# EAGLE design power_strip_monitor_reduced (EAGLE 6.1)
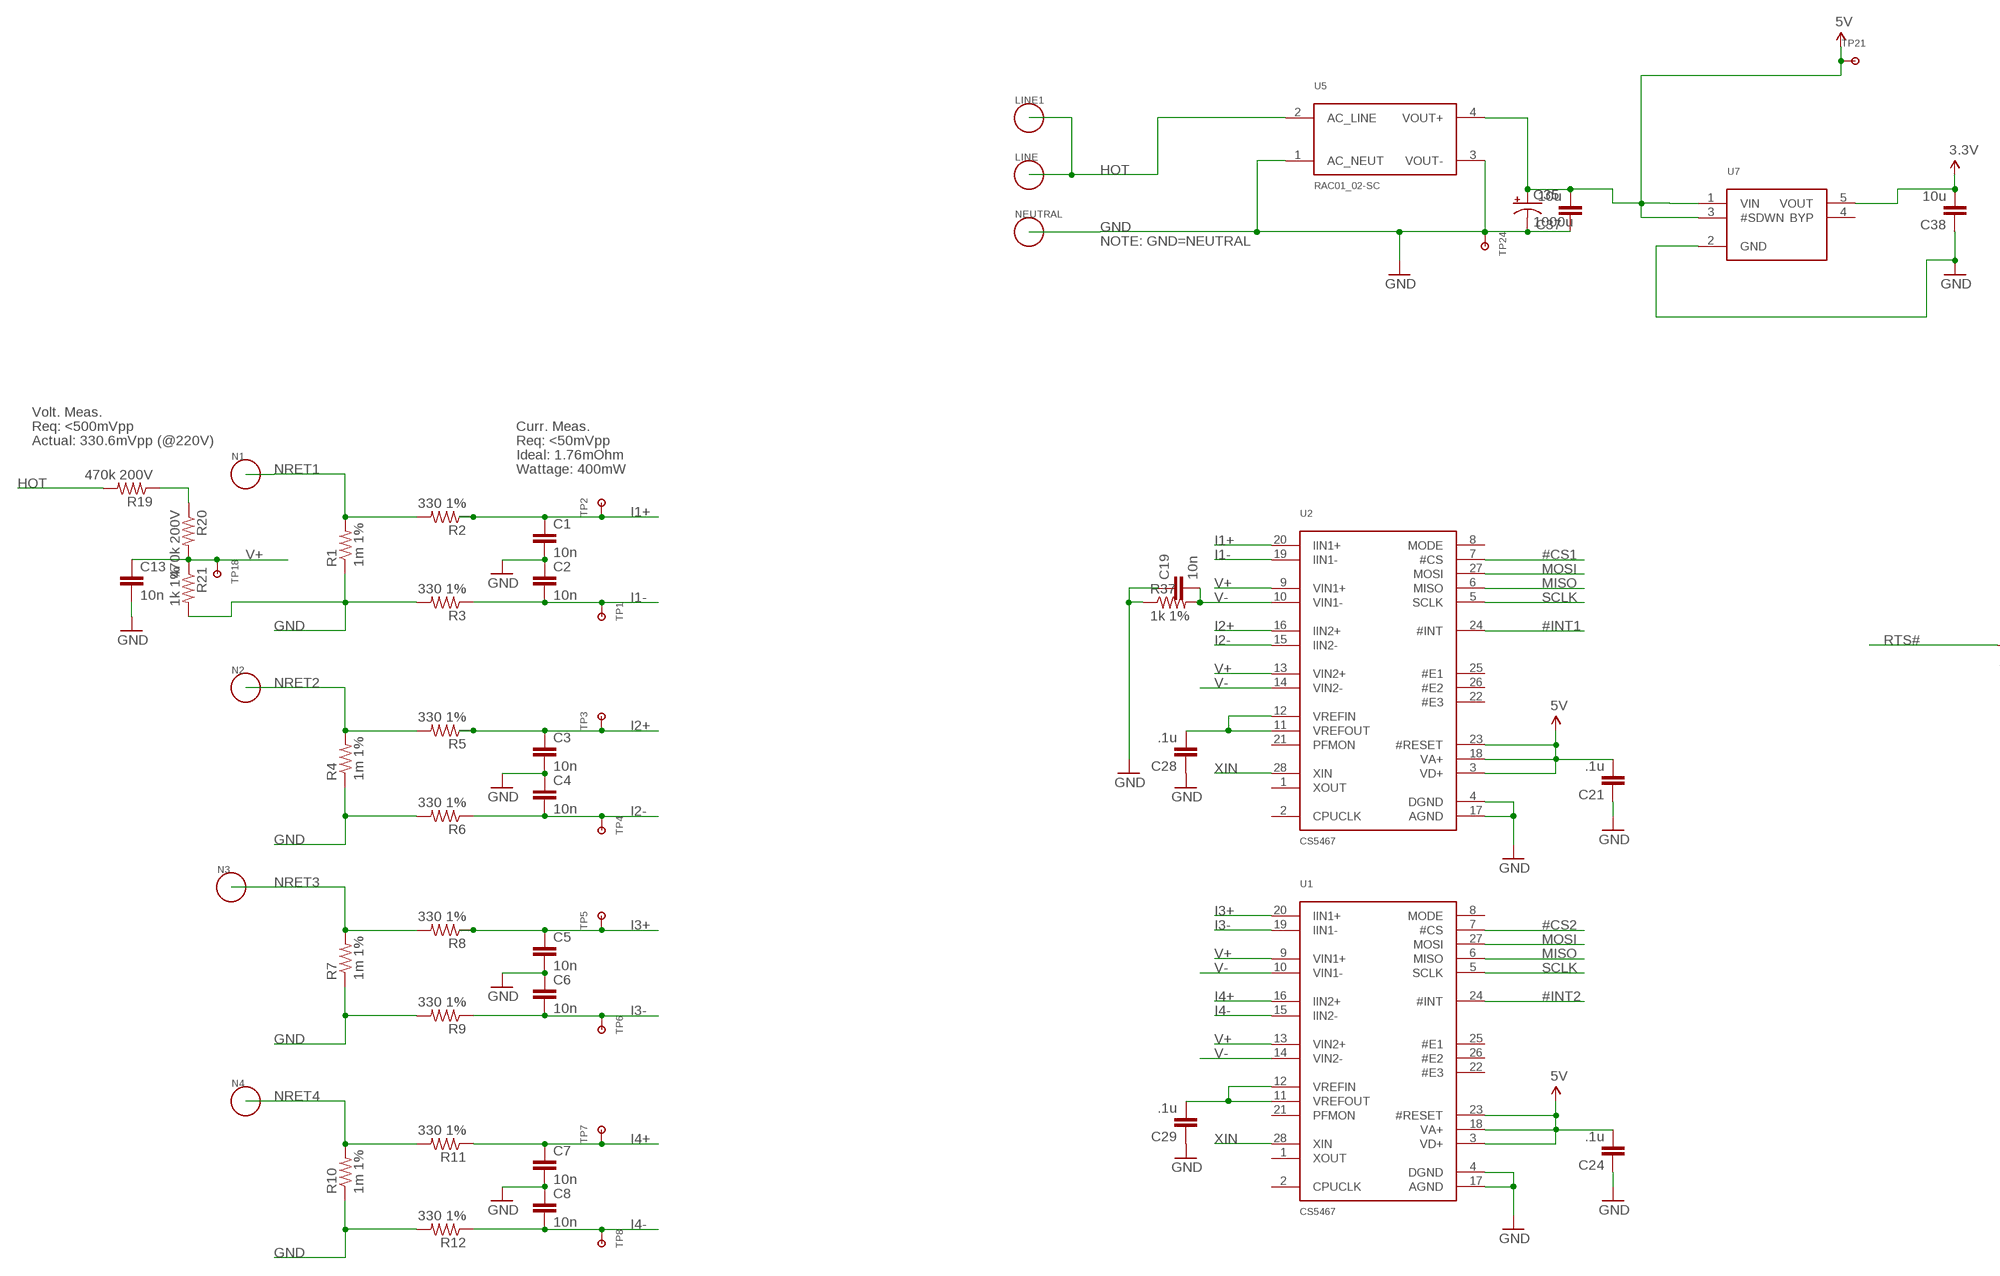
[diagram p0: schematic, sheet 1, part 1 of 2]
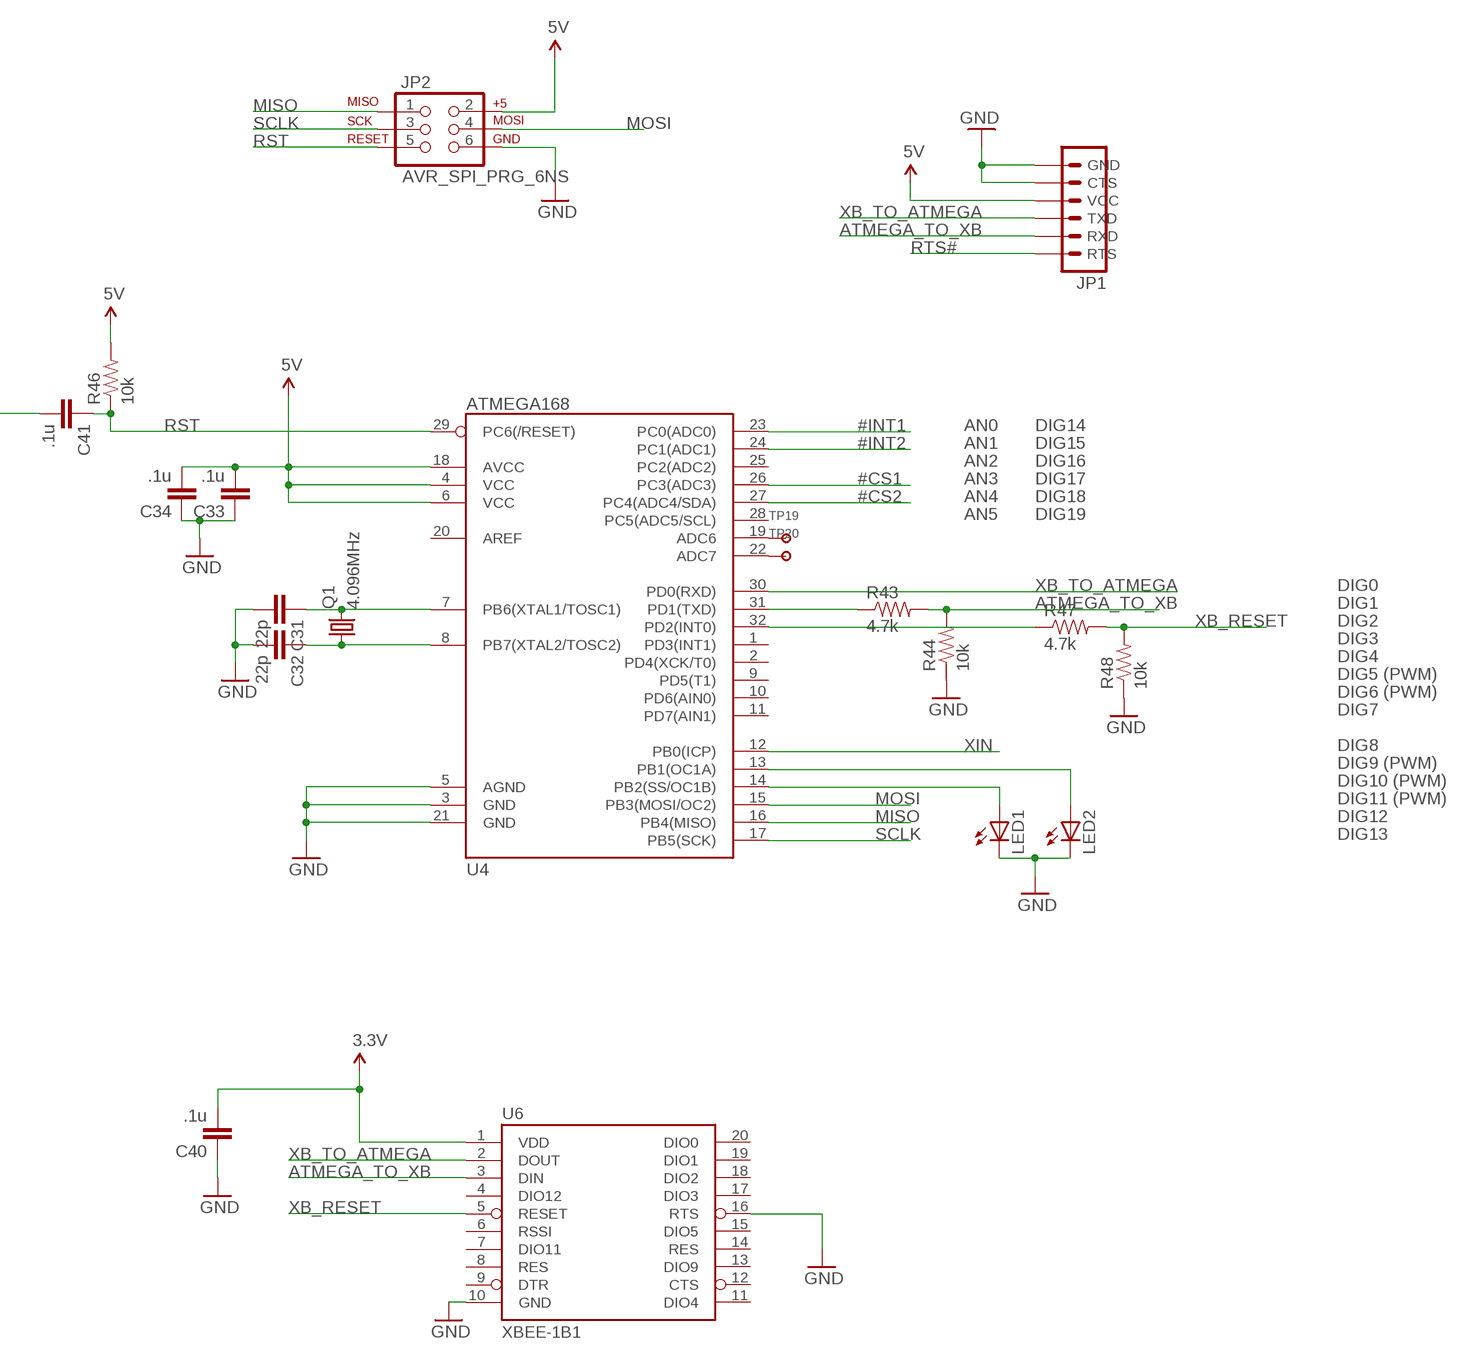
[diagram p1: schematic, sheet 1, part 2 of 2]

## Parts
C1  10n  CAP0603  [0603]
C2  10n  CAP0603  [0603]
C3  10n  CAP0603  [0603]
C4  10n  CAP0603  [0603]
C5  10n  CAP0603  [0603]
C6  10n  CAP0603  [0603]
C7  10n  CAP0603  [0603]
C8  10n  CAP0603  [0603]
C13  10n  CAP0603  [0603]
C19  10n  CAP0603  [0603]
C21  .1u  CAP0603  [0603]
C24  .1u  CAP0603  [0603]
C28  .1u  CAP0603  [0603]
C29  .1u  CAP0603  [0603]
C31  22p  CAP0603  [0603]
C32  22p  CAP0603  [0603]
C33  .1u  CAP0603  [0603]
C34  .1u  CAP0603  [0603]
C35  1000u  CPOL-USG  [PANASONIC_G]
C37  10u  CAP0603  [0603]
C38  10u  CAP0603  [0603]
C40  .1u  CAP0603  [0603]
C41  .1u  CAP0603  [0603]
JP1  FTDI_CABLESIP  [1X06]
JP2  AVR_SPI_PRG_6NS  [2X3-NS]
LED1  LEDCHIPLED_0805  [CHIPLED_0805]
LED2  LEDCHIPLED_0805  [CHIPLED_0805]
LINE  1P_HOLE  [14GAUGE_HOLE]
LINE1  1P_HOLE  [14GAUGE_HOLE]
N1  1P_HOLE  [14GAUGE_HOLE]
N2  1P_HOLE  [14GAUGE_HOLE]
N3  1P_HOLE  [14GAUGE_HOLE]
N4  1P_HOLE  [14GAUGE_HOLE]
NEUTRAL  1P_HOLE  [14GAUGE_HOLE]
Q1  4.096MHz  CRYSTALSMD  [HC49UP]
R1  1m 1%  R-US_R2512  [R2512]
R2  330 1%  RESISTOR0603  [0603]
R3  330 1%  RESISTOR0603  [0603]
R4  1m 1%  R-US_R2512  [R2512]
R5  330 1%  RESISTOR0603  [0603]
R6  330 1%  RESISTOR0603  [0603]
R7  1m 1%  R-US_R2512  [R2512]
R8  330 1%  RESISTOR0603  [0603]
R9  330 1%  RESISTOR0603  [0603]
R10  1m 1%  R-US_R2512  [R2512]
R11  330 1%  RESISTOR0603  [0603]
R12  330 1%  RESISTOR0603  [0603]
R19  470k 200V  RESISTOR1206  [1206]
R20  470k 200V  RESISTOR1206  [1206]
R21  1k 1%  RESISTOR0603  [0603]
R37  1k 1%  RESISTOR0603  [0603]
R43  4.7k  RESISTOR0603  [0603]
R44  10k  RESISTOR0603  [0603]
R46  10k  RESISTOR0603  [0603]
R47  4.7k  RESISTOR0603  [0603]
R48  10k  RESISTOR0603  [0603]
TP1  TESTPOINTSMALLEST  [TESTPOINT]
TP2  TESTPOINTSMALLEST  [TESTPOINT]
TP3  TESTPOINTSMALLEST  [TESTPOINT]
TP4  TESTPOINTSMALLEST  [TESTPOINT]
TP5  TESTPOINTSMALLEST  [TESTPOINT]
TP6  TESTPOINTSMALLEST  [TESTPOINT]
TP7  TESTPOINTSMALLEST  [TESTPOINT]
TP8  TESTPOINTSMALLEST  [TESTPOINT]
TP18  TESTPOINTSMALLEST  [TESTPOINT]
TP19  TESTPOINTSMALLEST  [TESTPOINT]
TP20  TESTPOINTSMALLEST  [TESTPOINT]
TP21  TESTPOINT100MIL  [TESTPOINT-100MIL]
TP24  TESTPOINT100MIL  [TESTPOINT-100MIL]
U1  CS5467  [SSOP28L_CIRRUS]
U2  CS5467  [SSOP28L_CIRRUS]
U4  ATMEGA168  [TQFP32-08]
U5  RAC01_02-SC  [RAC01_02-SC]
U6  XBEE-1B1  [XBEE-1]
U7  LT1761-X  [TSOT23-5_LINEAR]

## Nets
3.3V [power]: C38.2 C40.2 U6.1(VDD) U7.5(VOUT)
5V [power]: C21.2 C24.2 C33.2 C34.2 C35.+ C37.2 JP1.3(VCC) JP2.2 R46.2 TP21.2 U1.3(VD+) U1.18(VA+) U1.23(#RESET) U2.3(VD+) U2.18(VA+) U2.23(#RESET) U4.4(VCC) U4.6(VCC) U4.18(AVCC) U5.4(VOUT+) U7.1(VIN) U7.3(#SDWN)
#CS1: U2.7(#CS) U4.26(PC3(ADC3))
#CS2: U1.7(#CS) U4.27(PC4(ADC4/SDA))
#INT1: U2.24(#INT) U4.23(PC0(ADC0))
#INT2: U1.24(#INT) U4.24(PC1(ADC1))
ATMEGA_TO_XB: JP1.5(RXD) R43.2 R44.2 U6.3(DIN)
GND [power]: C1.2 C2.1 C3.2 C4.1 C5.2 C6.1 C7.2 C8.1 C13.2 C19.1 C21.1 C24.1 C28.1 C29.1 C31.2 C32.2 C33.1 C34.1 C35.- C37.1 C38.1 C40.1 JP1.1(GND) JP1.2(CTS) JP2.6 LED1.C LED2.C NEUTRAL.P$1 R1.1 R3.2 R4.1 R6.2 R7.1 R9.2 R10.1 R12.2 R21.2 R37.1 R44.1 R48.1 TP24.2 U1.4(DGND) U1.17(AGND) U2.4(DGND) U2.17(AGND) U4.3(GND) U4.5(AGND) U4.21(GND) U5.1(AC_NEUT) U5.3(VOUT-) U6.10(GND) U6.16(RTS) U7.2(GND)
HOT: LINE1.P$1 LINE.P$1 R19.2 U5.2(AC_LINE)
I1+: C1.1 R2.1 TP2.P$1 U2.20(IIN1+)
I1-: C2.2 R3.1 TP1.P$1 U2.19(IIN1-)
I2+: C3.1 R5.1 TP3.P$1 U2.16(IIN2+)
I2-: C4.2 R6.1 TP4.P$1 U2.15(IIN2-)
I3+: C5.1 R8.1 TP5.P$1 U1.20(IIN1+)
I3-: C6.2 R9.1 TP6.P$1 U1.19(IIN1-)
I4+: C7.1 R11.1 TP7.P$1 U1.16(IIN2+)
I4-: C8.2 R12.1 TP8.P$1 U1.15(IIN2-)
MISO: JP2.1 U1.6(MISO) U2.6(MISO) U4.16(PB4(MISO))
MOSI: JP2.4 U1.27(MOSI) U2.27(MOSI) U4.15(PB3(MOSI/OC2))
N$1: LED2.A U4.13(PB1(OC1A))
N$2: R19.1 R20.1
N$3: LED1.A U4.14(PB2(SS/OC1B))
N$11: C29.2 U1.11(VREFOUT) U1.12(VREFIN)
N$15: C28.2 U2.11(VREFOUT) U2.12(VREFIN)
N$16: C31.1 Q1.2 U4.7(PB6(XTAL1/TOSC1))
N$17: C32.1 Q1.1 U4.8(PB7(XTAL2/TOSC2))
N$18: TP19.P$1 U4.19(ADC6)
N$19: TP20.P$1 U4.22(ADC7)
N$20: R43.1 U4.31(PD1(TXD))
N$22: R47.1 U4.32(PD2(INT0))
NRET1: N1.P$1 R1.2 R2.2
NRET2: N2.P$1 R4.2 R5.2
NRET3: N3.P$1 R7.2 R8.2
NRET4: N4.P$1 R10.2 R11.2
RST: C41.1 JP2.5 R46.1 U4.29(PC6(/RESET))
RTS#: C41.2 JP1.6(RTS)
SCLK: JP2.3 U1.5(SCLK) U2.5(SCLK) U4.17(PB5(SCK))
V+: C13.1 R20.2 R21.1 TP18.P$1 U1.9(VIN1+) U1.13(VIN2+) U2.9(VIN1+) U2.13(VIN2+)
V-: C19.2 R37.2 U1.10(VIN1-) U1.14(VIN2-) U2.10(VIN1-) U2.14(VIN2-)
XB_RESET: R47.2 R48.2 U6.5(RESET)
XB_TO_ATMEGA: JP1.4(TXD) U4.30(PD0(RXD)) U6.2(DOUT)
XIN: U1.28(XIN) U2.28(XIN) U4.12(PB0(ICP))
Unconnected: U1.1(XOUT) U1.2(CPUCLK) U1.8(MODE) U1.21(PFMON) U1.22(#E3) U1.25(#E1) U1.26(#E2) U2.1(XOUT) U2.2(CPUCLK) U2.8(MODE) U2.21(PFMON) U2.22(#E3) U2.25(#E1) U2.26(#E2) U4.1(PD3(INT1)) U4.2(PD4(XCK/T0)) U4.9(PD5(T1)) U4.10(PD6(AIN0)) U4.11(PD7(AIN1)) U4.20(AREF) U4.25(PC2(ADC2)) U4.28(PC5(ADC5/SCL)) U6.4(DIO12) U6.6(RSSI) U6.7(DIO11) U6.8(RES) U6.9(DTR) U6.11(DIO4) U6.12(CTS) U6.13(DIO9) U6.14(RES) U6.15(DIO5) U6.17(DIO3) U6.18(DIO2) U6.19(DIO1) U6.20(DIO0) U7.4(BYP)

## Notes on the sheet
- NOTE: GND=NEUTRAL
- Volt. Meas.
- Req: <500mVpp | Curr. Meas.
- Actual: 330.6mVpp (@220V) | Req: <50mVpp
- Ideal: 1.76mOhm
- Wattage: 400mW
- AN0 | DIG14
- AN1 | DIG15
- AN2 | DIG16
- AN3 | DIG17
- AN4 | DIG18
- AN5 | DIG19
- DIG0
- DIG1
- DIG2
- DIG3
- DIG4
- DIG5 (PWM)
- DIG6 (PWM)
- DIG7
- DIG8
- DIG9 (PWM)
- DIG10 (PWM)
- DIG11 (PWM)
- DIG12
- DIG13

## Library data of the parts
C1-C8 C13 C19 C21 C24 C28 C29 C31-C34 C37 C38 C40 C41 = SparkFun:CAP: Capacitor Standard 0603 ceramic capacitor, and 0.1" leaded capacitor.
C35 = rcl_new:CPOL-US: POLARIZED CAPACITOR, American symbol
JP1 = custom:FTDI_CABLE: Header 6 Standard 6-pin 0.1" header. Use with straight break away headers (SKU : PRT-00116), right angle break away headers (PRT-00553), swiss pins (PRT-00743), machine pins (PRT-00117), and female headers (PRT-00115). Molex polarized connector foot print use with SKU : PRT-08094 with associated crimp pins and housings. NOTES ON THE VARIANTS LOCK and LOCK_LONGPADS... This footprint was designed to help hold the alignment of a through-hole component (i.e. 6-pin header) while soldering it into place. You may notice that each hole has been shifted either up or down by 0.005 of an inch from it's more standard position (which is a perfectly straight line). This slight alteration caused the pins (the squares in the middle) to touch the edges of the holes. Because they are alternating, it causes a "brace" to hold the component in place. 0.005 has proven to be the perfect amount of "off-center" position when using our standard breakaway headers. Although looks a little odd when you look at the bare footprint, once you have a header in there, the alteration is very hard to notice. Also, if you push a header all the way into place, it is covered up entirely on the bottom side. This idea of altering the position of holes to aid alignment will be further integrated into the Sparkfun Library for other footprints. It can help hold any component with 3 or more connection pins.
JP2 = SparkFun:AVR_SPI_PRG_6: AVR ISP 6 Pin This is the reduced ISP connector for AVR programming. Common on Arduino. This footprint will take up less PCB space and can be used with a 10-pin to 6-pin adapter such as SKU: BOB-08508
LED1 LED2 = led:LED: LED OSRAM: - CHIPLED LG R971, LG N971, LY N971, LG Q971, LY Q971, LO R971, LY R971 LH N974, LH R974 LS Q976, LO Q976, LY Q976 LO Q996 - Hyper CHIPLED LW Q18S LB Q993, LB Q99A, LB R99A - SideLED LS A670, LO A670, LY A670, LG A670, LP A670 LB A673, LV A673, LT A673, LW A673 LH A674 LY A675 LS A676, LA A676, LO A676, LY A676, LW A676 LS A679, LY A679, LG A679 - Hyper Micro SIDELED® LS Y876, LA Y876, LO Y876, LY Y876 LT Y87S - SmartLED LW L88C, LW L88S LB L89C, LB L89S, LG L890 LS L89K, LO L89K, LY L89K LS L896, LA L896, LO L896, LY L896 - TOPLED LS T670, LO T670, LY T670, LG T670, LP T670 LSG T670, LSP T670, LSY T670, LOP T670, LYG T670 LG T671, LOG T671, LSG T671 LB T673, LV T673, LT T673, LW T673 LH T674 LS T676, LA T676, LO T676, LY T676, LB T676, LH T676, LSB T676, LW T676 LB T67C, LV T67C, LT T67C, LS T67K, LO T67K, LY T67K, LW E67C LS E67B, LA E67B, LO E67B, LY E67B, LB E67C, LV E67C, LT E67C LW T67C LS T679, LY T679, LG T679 LS T770, LO T770, LY T770, LG T770, LP T770 LB T773, LV T773, LT T773, LW T773 LH T774 LS E675, LA E675, LY E675, LS T675 LS T776, LA T776, LO T776, LY T776, LB T776 LHGB T686 LT T68C, LB T68C - Hyper Mini TOPLED® LB M676 - Mini TOPLED Santana® LG M470 LS M47K, LO M47K, LY M47K Source: http://www.osram.convergy.de LUXEON: - LUMILED® LXK2-PW12-R00, LXK2-PW12-S00, LXK2-PW14-U00, LXK2-PW14-V00 LXK2-PM12-R00, LXK2-PM12-S00, LXK2-PM14-U00 LXK2-PE12-Q00, LXK2-PE12-R00, LXK2-PE12-S00, LXK2-PE14-T00, LXK2-PE14-U00 LXK2-PB12-K00, LXK2-PB12-L00, LXK2-PB12-M00, LXK2-PB14-N00, LXK2-PB14-P00, LXK2-PB14-Q00 LXK2-PR12-L00, LXK2-PR12-M00, LXK2-PR14-Q00, LXK2-PR14-R00 LXK2-PD12-Q00, LXK2-PD12-R00, LXK2-PD12-S00 LXK2-PH12-R00, LXK2-PH12-S00 LXK2-PL12-P00, LXK2-PL12-Q00, LXK2-PL12-R00 Source: www.luxeon.com KINGBRIGHT: KA-3528ASYC Source: www.kingbright.com
LINE LINE1 N1-N4 NEUTRAL = Cool_Electricity:1P_HOLE
Q1 = SparkFun:CRYSTAL: Crystals Various standard crystals. Proven footprints. Spark Fun Electronics SKU : COM-00534
R1 R4 R7 R10 = rcl:R-US_: RESISTOR, American symbol
R2 R3 R5 R6 R8 R9 R11 R12 R19-R21 R37 R43 R44 R46-R48 = SparkFun:RESISTOR: Resistor Basic schematic elements and footprints for 0603, 1206, and PTH 1/10th watt (small) resistors.
TP1-TP8 TP18-TP21 TP24 = WSNlib:TESTPOINT: Generic Testpoint
U1 U2 = Cool_Electricity:CS5467: CS5467 Power monitoring chip
U4 = SparkFun:ATMEGA168
U5 = Cool_Electricity:RAC01_02-SC: RAC_01_02-SC AC/DC converter 1W 5V out
U6 = SparkFun:XBEE-1
U7 = Cool_Electricity:LT1761-X: LT1761-X LDO Voltage Regulator

## Net classes
0 default: width 0.254 mm, drill 0.33 mm, clearance 0.254 mm
1 power: width 0.254 mm, drill 0.33 mm, clearance 0.254 mm

## Board
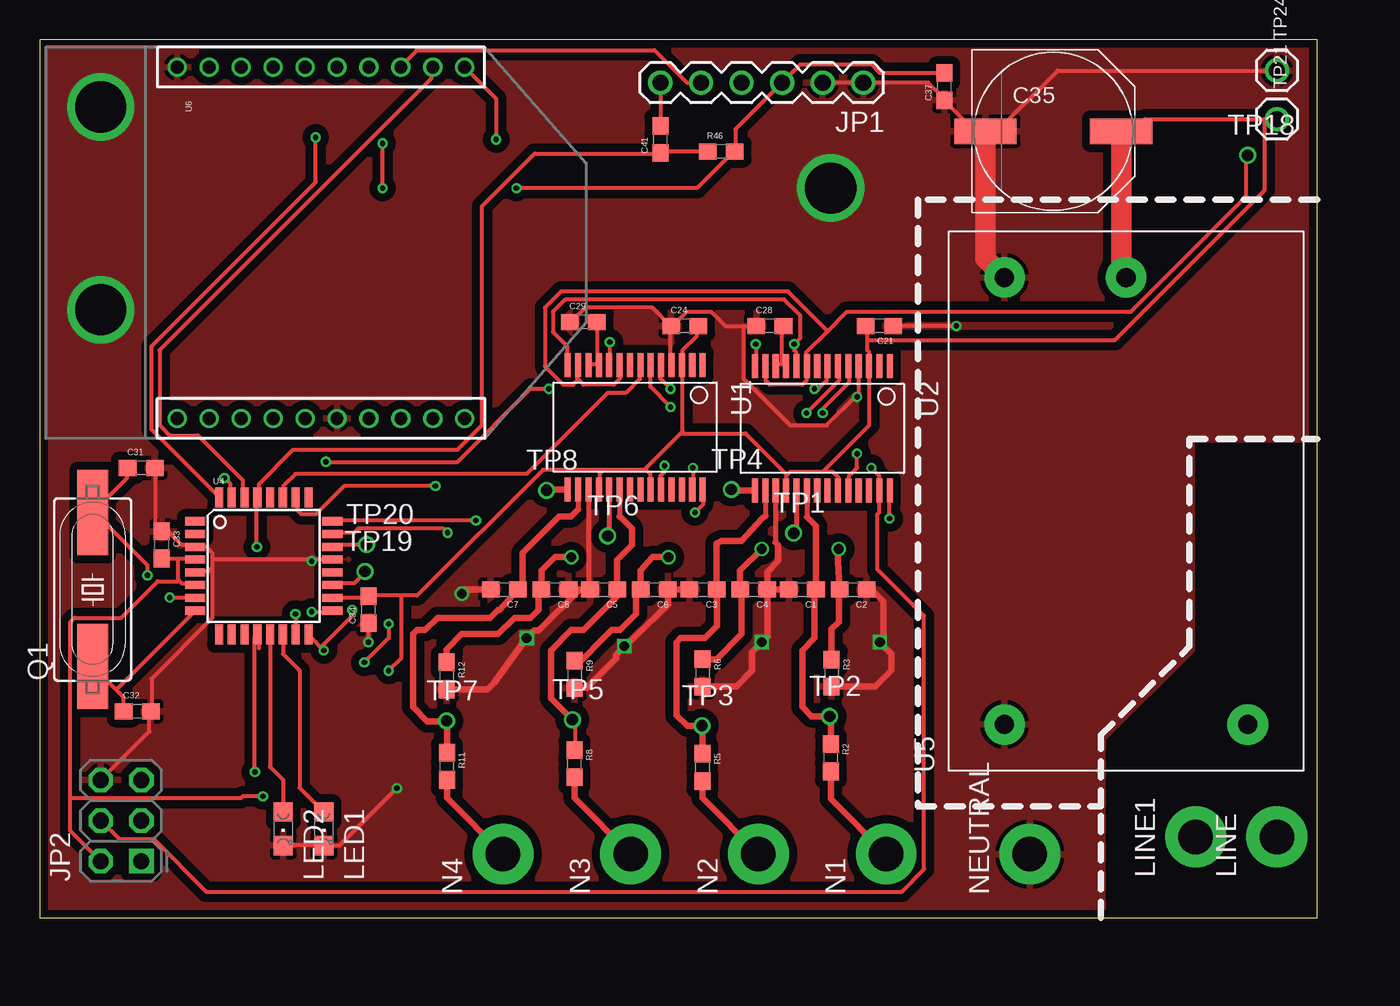
[diagram p2: board, top side]
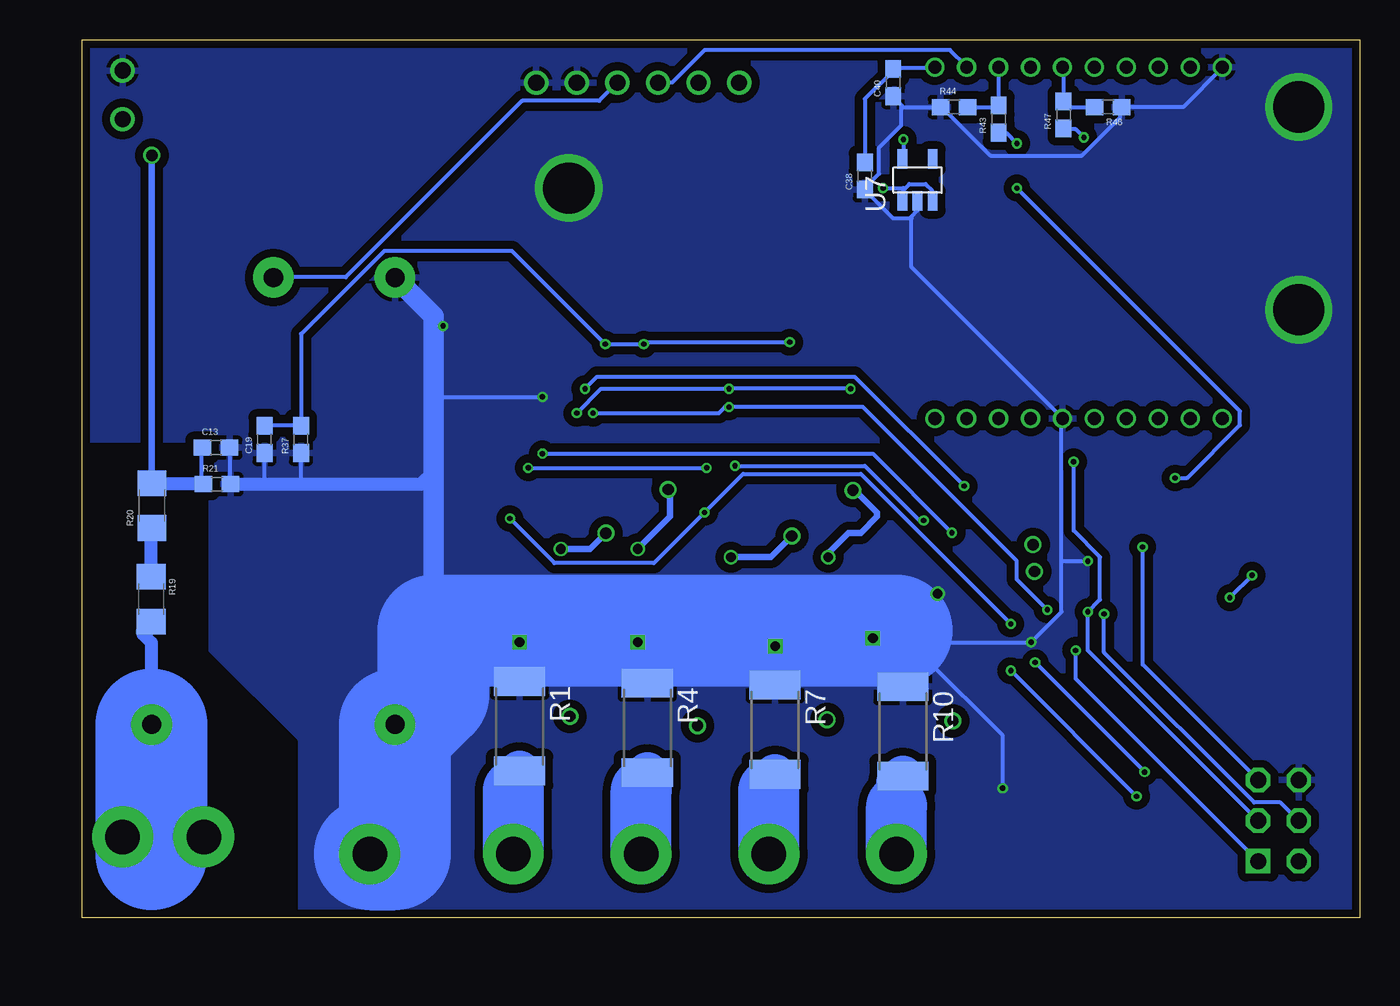
[diagram p3: board, bottom side, seen from below]

Size 80 x 55 mm. Coordinates in mm from the lower left corner, seen from the top.
Outline: 0,0 80,0 80,55 0,55 0,0
Copper layers (1*16): Top 0.035mm / dielectric 1.5mm / Bottom 0.035mm
Design rules: minimum track width 6mil, minimum drill 12mil, track to track 6mil, track to pad 6mil, pad to pad 6mil, via to via 6mil, smd to smd 0mil, copper to edge 10mil, drill to drill 10mil, minimum pad ring 6mil, minimum via ring 6mil, stop-mask expansion 2mil, vias tented up to drill 100mil, thermal gap 10mil

### Footprints (pad centres in the part's own frame; a part is rotated, then mirrored left to right if it is on the bottom)
0603 = smd 1.1 x 1: 1 -0.85,0; 2 0.85,0
PANASONIC_G = smd 3.9 x 1.6: + 4.25,0; - -4.25,0
1X06 = drill 1.016: 1 0,0; 2 2.54,0; 3 5.08,0; 4 7.62,0; 5 10.16,0; 6 12.7,0
2X3-NS = drill 1.016 square: 1 -2.54,-1.27 | drill 1.016 octagon: 2 -2.54,1.27; 3 0,-1.27; 4 0,1.27; 5 2.54,-1.27; 6 2.54,1.27
CHIPLED_0805 = smd 1.2 x 1.2: A 0,-1.05; C 0,1.05
14GAUGE_HOLE = drill 2.159 pad 3.81: P$1 0,0
HC49UP = smd 5.334 x 1.93: 1 -4.826,0; 2 4.826,0
R2512 = smd 1.8 x 3.2: 1 -2.8,0; 2 2.8,0
1206 = smd 1.6 x 1.8: 1 -1.4,0; 2 1.4,0
TESTPOINT = drill 0.711 pad 1.016: P$1 0,0
TESTPOINT-100MIL = drill 1.016: 2 0,0
SSOP28L_CIRRUS = smd 1.5 x 0.38: 1 -3.9,4.225; 2 -3.9,3.575; 3 -3.9,2.925; 4 -3.9,2.275; 5 -3.9,1.625; 6 -3.9,0.975; 7 -3.9,0.325; 8 -3.9,-0.325; 9 -3.9,-0.975; 10 -3.9,-1.625; 11 -3.9,-2.275; 12 -3.9,-2.925; 13 -3.9,-3.575; 14 -3.9,-4.225; 15 3.9,-4.225; 16 3.9,-3.575; 17 3.9,-2.925; 18 3.9,-2.275; 19 3.9,-1.625; 20 3.9,-0.975; 21 3.9,-0.325; 22 3.9,0.325; 23 3.9,0.975; 24 3.9,1.625; 25 3.9,2.275; 26 3.9,2.925; 27 3.9,3.575; 28 3.9,4.225
TQFP32-08 = smd 1.27 x 0.508: 1 -4.293,2.8; 2 -4.293,2; 3 -4.293,1.2; 4 -4.293,0.4; 5 -4.293,-0.4; 6 -4.293,-1.2; 7 -4.293,-2; 8 -4.293,-2.8; 17 4.293,-2.8; 18 4.293,-2; 19 4.293,-1.2; 20 4.293,-0.4; 21 4.293,0.4; 22 4.293,1.2; 23 4.293,2; 24 4.293,2.8 | smd 0.508 x 1.27: 9 -2.8,-4.293; 10 -2,-4.293; 11 -1.2,-4.293; 12 -0.4,-4.293; 13 0.4,-4.293; 14 1.2,-4.293; 15 2,-4.293; 16 2.8,-4.293; 25 2.8,4.293; 26 2,4.293; 27 1.2,4.293; 28 0.4,4.293; 29 -0.4,4.293; 30 -1.2,4.293; 31 -2,4.293; 32 -2.8,4.293
RAC01_02-SC = drill 1.2 pad 2.54: 1 -14,7.62; 2 -14,-7.62; 3 14,7.62; 4 14,0
XBEE-1 = drill 0.8: 1 -11,20; 2 -11,18; 3 -11,16; 4 -11,14; 5 -11,12; 6 -11,10; 7 -11,8; 8 -11,6; 9 -11,4; 10 -11,2; 11 11,2; 12 11,4; 13 11,6; 14 11,8; 15 11,10; 16 11,12; 17 11,14; 18 11,16; 19 11,18; 20 11,20
TSOT23-5_LINEAR = smd 0.62 x 1.22: 1 -0.95,-1.31; 2 0,-1.31; 3 0.95,-1.31; 4 0.95,1.31; 5 -0.95,1.31

### Placement (x,y rotation side)
C1  47.75,20.57 180 top
C2  50.93,20.57 180 top
C3  41.53,20.57 180 top
C4  44.7,20.57 180 top
C5  35.31,20.57 180 top
C6  38.48,20.57 180 top
C7  29.08,20.57 180 top
C8  32.26,20.57 180 top
C13  71.63,29.46 0 bottom
C19  68.58,29.97 90 bottom
C21  52.58,37.08 180 top
C24  40.39,37.08 0 top
C28  45.72,37.08 0 top
C29  34.04,37.34 0 top
C31  6.35,28.19 0 top
C32  6.1,12.95 0 top
C33  7.62,23.37 270 top
C34  20.57,19.3 90 top
C35  63.47,49.27 0 top
C37  56.64,52.07 90 top
C38  30.99,46.48 90 bottom
C40  29.21,52.32 90 bottom
C41  38.86,48.77 90 top
JP1  51.56,52.32 180 top
JP2  5.08,6.1 90 top
LED1  17.78,5.59 180 top
LED2  15.24,5.59 180 top
LINE  77.47,5.08 0 top
LINE1  72.39,5.08 0 top
N1  53,4 0 top
N2  45,4 0 top
N3  37,4 0 top
N4  29,4 0 top
NEUTRAL  62,4 0 top
Q1  3.3,20.57 90 top
R1  52.61,12.02 270 bottom
R2  49.53,10.03 270 top
R3  49.59,15.34 270 top
R4  44.61,11.91 270 bottom
R5  41.49,9.43 270 top
R6  41.5,15.35 270 top
R7  36.61,11.8 270 bottom
R8  33.47,9.67 270 top
R9  33.49,15.26 270 top
R10  28.61,11.69 270 bottom
R11  25.49,9.5 270 top
R12  25.47,15.17 270 top
R19  75.69,19.97 270 bottom
R20  75.63,25.83 90 bottom
R21  71.57,27.17 0 bottom
R37  66.29,29.97 90 bottom
R43  22.61,50.04 90 bottom
R44  25.4,50.8 0 bottom
R46  42.67,48.01 0 top
R47  18.54,50.29 90 bottom
R48  15.75,50.8 180 bottom
TP1  47.2,24.1 0 top
TP2  49.46,12.63 0 top
TP3  41.47,12.04 0 top
TP4  43.3,26.84 0 top
TP5  33.35,12.42 0 top
TP6  35.55,23.93 0 top
TP7  25.47,12.34 0 top
TP8  31.73,26.79 0 top
TP18  75.64,47.77 0 top
TP19  20.36,21.7 0 top
TP20  20.45,23.39 0 top
TP21  77.47,50.04 0 top
TP24  77.47,53.09 0 top
U1  37.28,30.74 270 top
U2  49.01,30.66 270 top
U4  14.02,22.05 0 top
U5  68.03,26.12 90 top
U6  6.6,42.29 270 top
U7  27.69,46.23 0 bottom

### Tracks (layer width: path | path; a pad name or v marks a point on that pad's centre or on a via)
3.3V  (via drill 0.33)
  Top 0.254: v28.57,48.77 28.57,51.31 26.67,53.21 U6.1
  Bottom 0.254: U6.1 26.67,53.21 29.21,53.21 C40.2 29.21,53.09 30.99,51.31 30.99,47.37 C38.2 | v28.57,48.77 28.57,47.62 U7.5
5V  (via drill 0.33)
  Top 0.254: 76.71,50.04 69.22,50.04 68.2,49.02 C35.+ | 76.71,50.04 TP21.2 | C37.2 56.64,52.96 52.58,52.96 52.07,53.47 47.62,53.47 JP1.3 43.56,49.4 43.56,48.01 R46.2 43.43,48.01 41.15,45.72 v29.84,45.72 | 8.64,22.48 9.65,22.48 U4.4 | 8.64,22.48 7.62,22.48 C33.2 | 8.7,21.14 8.64,21.21 8.64,22.48 | 8.7,21.14 8.89,20.95 9.65,20.95 U4.6 | 1.91,7.49 1.91,5.46 JP2.2 | 1.91,7.49 1.91,18.54 2.16,18.8 5.08,18.8 7.37,21.08 8.64,21.08 8.7,21.14 | 51.82,36.2 51.82,35.56 51.94,35.43 51.94,34.67 U2.3 51.94,34.54 51.94,30.86 49.02,27.94 | 51.82,36.2 51.82,37.08 C21.2 | 46.8,27.75 46.99,27.94 49.02,27.94 | 46.8,27.75 46.74,27.69 46.74,26.8 U2.18 | 49.02,27.94 49.66,27.94 50.04,27.56 50.04,26.8 U2.23 | C24.2 41.15,37.08 41.15,36.45 40.26,35.56 40.26,34.67 U1.3 40.26,34.54 40.26,30.48 40.2,30.42 | U4.18 18.41,20.07 20.57,20.07 C34.2 20.57,20.19 22.61,20.19 | 35.24,28 35.31,28.07 37.85,28.07 | 35.24,28 35.05,27.81 35.05,26.92 U1.18 | 37.85,28.07 37.97,28.07 38.23,27.81 38.23,26.92 U1.23 | 22.61,20.19 23.62,20.19 31.5,28.07 35.18,28.07 35.24,28 | 37.85,28.07 40.2,30.42 | 46.8,27.75 44.2,30.35 40.26,30.35 40.2,30.42 | 1.91,7.49 12.57,7.49 12.7,7.62 v13.97,7.62 | 22.61,20.19 22.61,16.26 v21.84,15.49 | 76.71,50.04 76.71,45.59 67.31,36.2 51.82,36.2
  Top 1.27: C35.+ 67.72,40.43 U5.4
  Bottom 0.254: 28.51,45.66 28.57,45.59 28.57,44.96 U7.1 | 28.51,45.66 28.19,45.97 27.18,45.97 26.8,45.59 26.8,44.96 U7.3 | v29.84,45.72 28.57,45.72 28.51,45.66 | JP1.3 47.62,51.18 52.45,51.18 63.5,40.13 67.94,40.13 U5.4 | v21.84,15.49 v13.97,7.62
#CS1  (via drill 0.33)
  Top 0.254: v24.77,27.05 19.05,27.05 17.27,25.27 16.38,25.27 16.13,25.53 16.13,26.29 U4.26 | v48.51,33.15 48.77,33.15 49.28,33.66 49.28,34.54 U2.7
  Bottom 0.254: v24.77,27.05 31.62,33.91 47.75,33.91 v48.51,33.15
#CS2
  Top 0.254: U4.27 15.24,26.42 15.24,27.05 16,27.81 30.48,27.81 35.56,32.89 36.7,32.89 37.59,33.78 37.59,34.54 U1.7
#INT1  (via drill 0.33)
  Top 0.254: v25.53,24.13 25.27,24.38 19.94,24.38 19.68,24.13 18.41,24.13 U4.23 | v51.18,29.08 51.18,28.19 50.67,27.69 50.67,26.8 U2.24
  Bottom 0.254: v25.53,24.13 30.48,29.08 v51.18,29.08
#INT2  (via drill 0.33)
  Top 0.254: v27.3,24.89 18.41,24.89 U4.24 | v39.12,28.32 39.12,27.94 38.86,27.69 38.86,26.92 U1.24
  Bottom 0.254: v27.3,24.89 27.56,24.89 30.99,28.32 v39.12,28.32
ATMEGA_TO_XB
  Top 0.254: JP1.5 40.51,52.32 38.48,54.36 23.62,54.36 22.61,53.34 U6.3
  Bottom 0.254: R44.2 24.51,50.8 22.61,50.8 R43.2 22.61,50.93 22.61,53.21 U6.3
GND  (via drill 0.33, 0.6, 3.2)
  Top 0.254: JP2.6 6.86,11.68 6.86,12.95 C32.2 6.99,12.95 6.99,14.99 10.79,18.8 10.79,21.84 10.73,21.91 | C31.2 7.24,28.19 7.24,24.64 7.62,24.26 C33.1 7.62,24.13 8.13,24.13 8.89,23.37 9.65,23.37 U4.3 9.78,23.24 10.41,23.24 10.79,22.86 10.79,22.48 | 10.73,21.91 10.79,21.97 10.79,22.48 | 10.73,21.91 10.54,21.72 9.78,21.72 U4.5 | 10.79,22.48 17.02,22.48 | 17.02,22.48 18.29,22.48 U4.21 | 39.5,37.08 39.5,34.67 U1.4 | 44.07,37.08 42.93,37.08 42.04,37.97 40.51,37.97 39.62,37.08 C24.1 39.5,37.08 | 44.07,37.08 C28.1 | 39.5,37.08 38.35,38.23 34.16,38.23 33.27,37.34 C29.1 | 51.12,32.7 49.28,30.86 46.99,30.86 44.07,33.78 44.07,37.08 | 51.12,32.7 51.31,32.89 51.31,34.54 U2.4 | JP1.2 JP1.1 55.63,52.32 56.64,51.31 C37.1 56.64,51.18 58.8,49.02 C35.- 59.69,49.02 63.75,53.09 TP24.2 | v20.57,17.27 C34.1 | v57.4,37.08 C21.1 | v51.18,32.64 51.12,32.7 | v17.02,22.35 17.02,22.48 | LED2.C LED1.C 18.76,4.54 v22.35,8.13
  Top 0.305: U2.17 46.08,23.52 | U1.17 34.35,20.68
  Top 0.406: R12.2 28.03,14.32 28.45,14.73 v30.48,17.53 30.95,18 31.24,18 33.82,20.57 C5.2 | R9.2 34.22,14.41 36.07,16.26 36.07,16.48 v36.61,17.02 39.33,19.61 C6.1 C3.2 | R6.2 43.62,14.5 44.61,15.49 44.61,16.67 v45.21,17.27 45.55,17.61 C4.1 | R3.2 52.34,14.49 53.34,15.49 53.34,16.54 v52.61,17.27 | 52.58,17.3 v52.61,17.27 | C2.1 52.07,20.57 52.83,19.81 52.83,17.49 v52.61,17.27 | C1.2 C4.1 | C4.1 45.55,21.68 46.23,22.35 46.23,23.37 46.08,23.52 | C5.2 C8.1 | C7.2 26.67,20.57 v26.42,20.32 | 34.35,20.68 C5.2
  Top 1.27: C35.- 59.22,41.31 U5.3
  Bottom 0.254: U6.10 8.64,53.21 11.05,50.8 R48.1 14.99,50.8 14.99,50.16 17.4,47.75 23.11,47.75 26.16,50.8 R44.1 28.57,50.8 28.64,50.86 | 28.64,50.86 29.21,51.44 C40.1 | 28.13,43.88 27.69,44.32 U7.2 | 28.13,43.88 28.19,43.81 29.21,43.81 30.99,45.59 C38.1 30.99,45.72 30.1,46.61 30.1,48.26 28.7,49.66 28.7,50.8 28.64,50.86 | 29,18 25.65,17.27 v20.57,17.27 18.67,19.18 18.67,22.35 | v57.4,37.08 58,37.08 | 66.29,27.17 R37.1 | 68.58,27.17 C19.1 | C13.2 70.74,29.46 70.74,27.56 R21.2 | 18.67,22.35 18.67,31.24 U6.16 18.67,31.37 28.07,40.77 28.07,43.81 28.13,43.88 | 58,32.64 v51.18,32.64 | 18.67,22.35 v17.02,22.35 | v22.35,8.13 22.35,11.43 27.18,16.26 28.36,16.26 28.61,16.51
  Bottom 0.406: v30.48,17.53 28.96,14.73 28.7,14.48 | 28.7,14.48 28.45,14.48 | R10.1 28.69,14.49 28.7,14.48 | v45.21,17.27 45.21,15.31 R4.1 | v26.42,20.32 26.68,20.32 29,18
  Bottom 0.813: R21.2 68.58,27.17 66.29,27.17 58.77,27.17 58,27.94
  Bottom 1.016: R10.1 28.61,16.51 28.61,17.61 29,18 | R7.1 v36.61,17.02 36.61,17.61 37,18 | R4.1 44.61,17.39 44,18 | R1.1 v52.61,17.27 52.61,17.61 53,18
  Bottom 1.27: 58,18 58,27.94 58,32.64 58,37.08 58,37.71 U5.3
  Bottom 7: NEUTRAL.P$1 60.41,4 U5.1 59.88,12.12 58,14 58,18 53,18 44,18 37,18 29,18
  other vias: 3.81,50.8 3.81,38.1 49.53,45.72
  pour Bottom (isolate 0.508): 0,0 0,55.12 79.76,55.12 79.76,29.97 71.88,29.97 71.88,16.76 66.29,11.18 66.29,0
  pour Top (isolate 0.508): 0.25,0 0.25,55.12 80.01,55.12 80.01,29.97 72.14,29.97 72.14,16.76 66.55,11.18 66.55,0
HOT
  Bottom 0.406: LINE1.P$1 75.65,5.08 | LINE.P$1 76.2,5.08 76.2,4 75.65,4
  Bottom 0.813: U5.2 75.65,17.23 76.2,17.78 76.2,18.06 R19.2
  Bottom 7: 75.65,4 75.65,5.08 U5.2
I1+
  Top 0.305: U2.20 48.03,25.12
  Top 0.406: R2.1 49.53,12.55 TP2.P$1 48.33,12.63 47.75,13.21 47.75,16.76 48.51,17.53 48.51,20.49 C1.1 48.6,24.55 48.51,24.64 48.03,25.12
I1-  (via drill 0.6)
  Top 0.254: 50.04,20.45 C2.2
  Top 0.305: U2.19 47.38,24.28
  Top 0.406: R3.1 49.59,18.09 50.04,18.54 50.04,20.45 50.04,20.57 | C2.2 49.95,23.03 v50.04,23.11 | 47.38,24.28 TP1.P$1
  Bottom 0.406: v50.04,23.11 48.19,23.11 TP1.P$1
I2+
  Top 0.305: U2.16 45.43,25.18
  Top 0.406: R5.1 41.49,12.02 | 41.49,12.02 TP3.P$1 | 41.49,12.02 40.56,12.02 39.88,12.7 39.88,17.27 40.13,17.53 41.66,17.53 42.42,18.29 42.42,20.49 C3.1 42.38,23.46 42.67,23.62 43.94,23.62 45.21,25.02 45.43,25.18
I2-  (via drill 0.6)
  Top 0.406: R6.1 42.36,16.2 43.94,17.78 43.94,20.49 C4.2 43.85,21.76 v45.21,23.11 | U2.15 43.38,26.76 TP4.P$1
  Bottom 0.406: v45.21,23.11 43.18,25.15 43.18,26.71 TP4.P$1
I3+
  Top 0.254: R8.1 33.53,10.54 33.53,12.32 TP5.P$1
  Top 0.305: U1.20 36.3,25.16
  Top 0.406: 36.3,25.16 36.32,25.15 37.08,24.38 37.08,23.37 36.16,22.44 C5.1 36.16,20.15 34.04,18.03 33.27,18.03 32,16.76 32,13.76 TP5.P$1
I3-  (via drill 0.6)
  Top 0.305: U1.19 35.66,24.03
  Top 0.406: R9.1 33.89,16.11 35.31,17.53 35.81,18.03 36.32,18.03 37.34,19.05 37.34,20.41 C6.2 37.63,21.76 38.35,22.61 v39.37,22.61 | 35.66,24.03 TP6.P$1
  Bottom 0.406: v39.37,22.61 36.88,22.61 TP6.P$1
I4+
  Top 0.305: U1.16 33.7,25.58
  Top 0.406: R11.1 25.49,12.33 | 25.49,12.33 TP7.P$1 | 33.7,25.58 33.27,25.15 32.51,25.15 30.23,22.86 30.23,20.74 C7.1 28.79,19.3 28.7,19.3 28.19,18.8 24.89,18.8 24.13,18.03 23.62,18.03 23.37,17.78 23.37,13.21 24.25,12.33 25.49,12.33
I4-  (via drill 0.6)
  Top 0.406: v33.27,22.61 32.26,22.61 31.41,21.76 C8.2 31.24,20.41 31.24,19.3 30.73,18.8 29.72,18.8 28.7,17.78 26.42,17.78 25.47,16.84 R12.1 | U1.15 31.78,26.84 TP8.P$1
  Bottom 0.406: v33.27,22.61 33.27,22.86 32,24.13 31.24,24.13 30.23,25.15 30.23,25.4 31.5,26.67 | 31.5,26.67 31.75,26.92 | TP8.P$1 31.61,26.79 31.5,26.67
MISO  (via drill 0.33)
  Top 0.254: v39.5,32 38.23,33.27 38.23,34.54 U1.6 | v48.01,31.62 50.04,33.66 50.04,34.54 U2.6 | U4.16 16.89,17.65 v17.78,16.76 17.65,17.02 19.56,18.92 v19.56,19.3
  Bottom 0.254: v48.01,31.62 40.13,31.62 39.75,32 v39.5,32 31.11,32 21.46,22.35 21.46,21.21 v19.56,19.3 | v17.78,16.76 17.78,14.99 JP2.1
MOSI  (via drill 0.33)
  Top 0.254: v40.89,28.19 40.89,26.92 U1.27 | v52.07,28.19 52.58,27.69 52.58,26.8 U2.27 52.58,26.67 52.58,25.4 52.45,25.27 52.45,21.84 55.37,18.92 55.37,3.05 53.98,1.65 10.41,1.65 7.11,4.95 4.95,4.95 JP2.4 | v16,19.05 16,17.78 U4.15
  Bottom 0.254: v52.07,28.19 v40.89,28.19 | v16,19.05 16,16.64 6.6,7.24 4.95,7.24 JP2.4
N$1
  Top 0.254: U4.13 14.42,9.46 15.24,8.64 LED2.A
N$2
  Bottom 0.813: R19.1 75.69,24.38 R20.1
N$3
  Top 0.254: U4.14 15.22,16.53 16.26,15.49 16.26,8.16 LED1.A
N$11
  Top 0.254: 34.92,34.67 34.92,37.34 C29.2 | 34.92,34.67 U1.11 | U1.12 34.42,34.67 34.8,34.67 34.92,34.67
N$15
  Top 0.254: 46.55,34.73 46.61,34.67 U2.11 | 46.55,34.73 46.48,34.8 46.48,37.08 C28.2 | U2.12 46.1,34.67 46.48,34.67 46.55,34.73
N$16  (via drill 0.33)
  Top 0.254: C31.1 5.46,28.19 5.46,27.56 Q1.2 3.43,25.4 6.73,22.1 v6.73,21.46 | v8.13,20.07 9.65,20.07 U4.7
  Bottom 0.254: v6.73,21.46 v8.13,20.07
N$17
  Top 0.254: Q1.1 4.76,14.29 | 4.76,14.29 5.21,13.84 5.21,12.95 C32.1 | U4.8 9.65,19.18 4.83,14.35 4.76,14.29
N$18
  Top 0.254: U4.19 18.41,20.95 19.68,20.95 20.32,21.59 TP19.P$1
N$19
  Top 0.254: U4.22 18.41,23.37 20.45,23.37 TP20.P$1
N$20  (via drill 0.33)
  Top 0.254: v21.46,45.72 v21.46,48.51 | v11.56,27.56 11.94,27.18 11.94,26.42 U4.31
  Bottom 0.254: v21.46,48.51 22.1,49.15 22.61,49.15 R43.1 | v21.46,45.72 7.49,31.75 7.49,30.86 10.79,27.56 v11.56,27.56
N$22  (via drill 0.33)
  Top 0.254: v17.27,48.9 17.27,46.1 6.99,35.81 6.99,30.61 11.18,26.42 U4.32
  Bottom 0.254: v17.27,48.9 17.78,49.4 18.54,49.4 R47.1
NRET1
  Top 0.406: R2.2 49.53,7.47 N1.P$1
  Bottom 2.54: 53,8 53,8.83 R1.2
  Bottom 3.81: N1.P$1 53,8
NRET2
  Top 0.406: R5.2 41.49,7.51 N2.P$1
  Bottom 2.54: 45,8 45,8.72 R4.2
  Bottom 3.81: N2.P$1 45,8
NRET3
  Top 0.406: R8.2 33.47,7.53 N3.P$1
  Bottom 2.54: 37,8 37,8.61 R7.2
  Bottom 3.81: N3.P$1 37,8
NRET4
  Top 0.406: R11.2 25.49,7.51 N4.P$1
  Bottom 2.54: 29,7 29,8.5 R10.2
  Bottom 3.81: N4.P$1 29,7
RST  (via drill 0.33)
  Top 0.254: R46.1 41.78,48.01 38.86,48.01 C41.1 38.86,47.88 30.99,47.88 27.69,44.58 27.69,30.86 26.16,29.34 15.88,29.34 13.72,27.18 13.72,26.42 U4.29 13.59,26.29 v13.59,23.24
  Bottom 0.254: v13.59,23.24 13.59,15.88 JP2.5
RTS#
  Top 0.254: JP1.6 38.86,49.66 C41.2
SCLK  (via drill 0.33)
  Top 0.254: v39.5,33.15 38.86,33.78 38.86,34.54 U1.5 | v49.02,31.62 49.02,31.88 50.67,33.53 50.67,34.54 U2.5 | v17.02,19.18 18.29,19.18 U4.17 | v31.88,33.15 30.73,33.15 26.16,28.57 v17.91,28.57
  Bottom 0.254: v49.02,31.62 47.5,33.15 v39.5,33.15 v31.88,33.15 | JP2.3 17.02,16.76 v17.02,19.18 16.26,19.94 16.26,22.61 17.91,24.26 v17.91,28.57
V+
  Top 0.254: 33.72,33.72 34.04,33.4 35.94,33.4 36.32,33.78 36.32,34.54 U1.9 | 33.72,33.72 33.66,33.78 33.66,34.54 U1.13 | U2.13 45.47,34.54 45.47,33.66 45.72,33.4 47.75,33.4 48.01,33.66 48.01,34.54 U2.9 48.01,34.67 48.01,35.43 49.34,36.77 | 49.34,36.77 50.55,37.97 68.33,37.97 75.56,45.21 75.56,47.75 TP18.P$1 | 33.72,33.72 33.66,33.66 33.4,33.4 32.77,33.4 31.62,34.54 31.62,38.23 32.64,39.24 46.86,39.24 49.28,36.83 49.34,36.77
  Bottom 0.254: C13.1 72.52,29.46 72.52,27.56 R21.1
  Bottom 0.406: TP18.P$1 R20.2
  Bottom 0.813: R20.2 72.48,27.23 R21.1
V-  (via drill 0.33)
  Top 0.254: v44.83,35.94 44.83,34.67 U2.14 | U2.10 47.37,34.67 47.37,35.43 47.24,35.56 v47.24,35.94 47.62,36.32 47.62,37.72 46.61,38.73 32.89,38.73 32.13,37.97 32.13,36.7 33.02,35.81 33.02,34.67 U1.14 | v35.69,36.07 35.69,34.67 U1.10
  Bottom 0.254: 66.29,30.86 68.58,30.86 C19.2 | 66.29,30.86 R37.2 66.29,30.86 | v35.69,36.07 44.7,36.07 v44.83,35.94 v47.24,35.94 53.09,41.78 61.09,41.78 66.29,36.58 66.29,30.86
XB_RESET
  Bottom 0.254: R48.2 16.64,50.8 18.29,50.8 18.54,51.05 R47.2 18.54,51.18 18.54,53.21 U6.5
XB_TO_ATMEGA
  Top 0.254: U4.30 12.7,26.42 12.7,27.43 9.91,30.23 8.13,30.23 7.49,30.86 7.49,35.56 24.51,52.58 24.51,53.21 U6.2
  Bottom 0.254: JP1.4 43.05,52.32 41.02,54.36 25.65,54.36 24.64,53.34 U6.2
XIN  (via drill 0.33)
  Top 0.254: 13.72,16.89 13.72,17.65 U4.12 13.46,17.6 v13.46,9.14 | v20.32,16 21.84,17.53 v21.84,18.41 | v41.02,25.4 41.53,25.91 41.53,26.8 U1.28 | v53.21,25.02 53.21,26.67 U2.28
  Bottom 0.254: v21.84,18.41 31.24,27.81 38.61,27.81 v41.02,25.4 44.2,22.23 50.42,22.23 v53.21,25.02 | v20.32,16 v13.46,9.14